# Altium project Linelance.PrjPcb
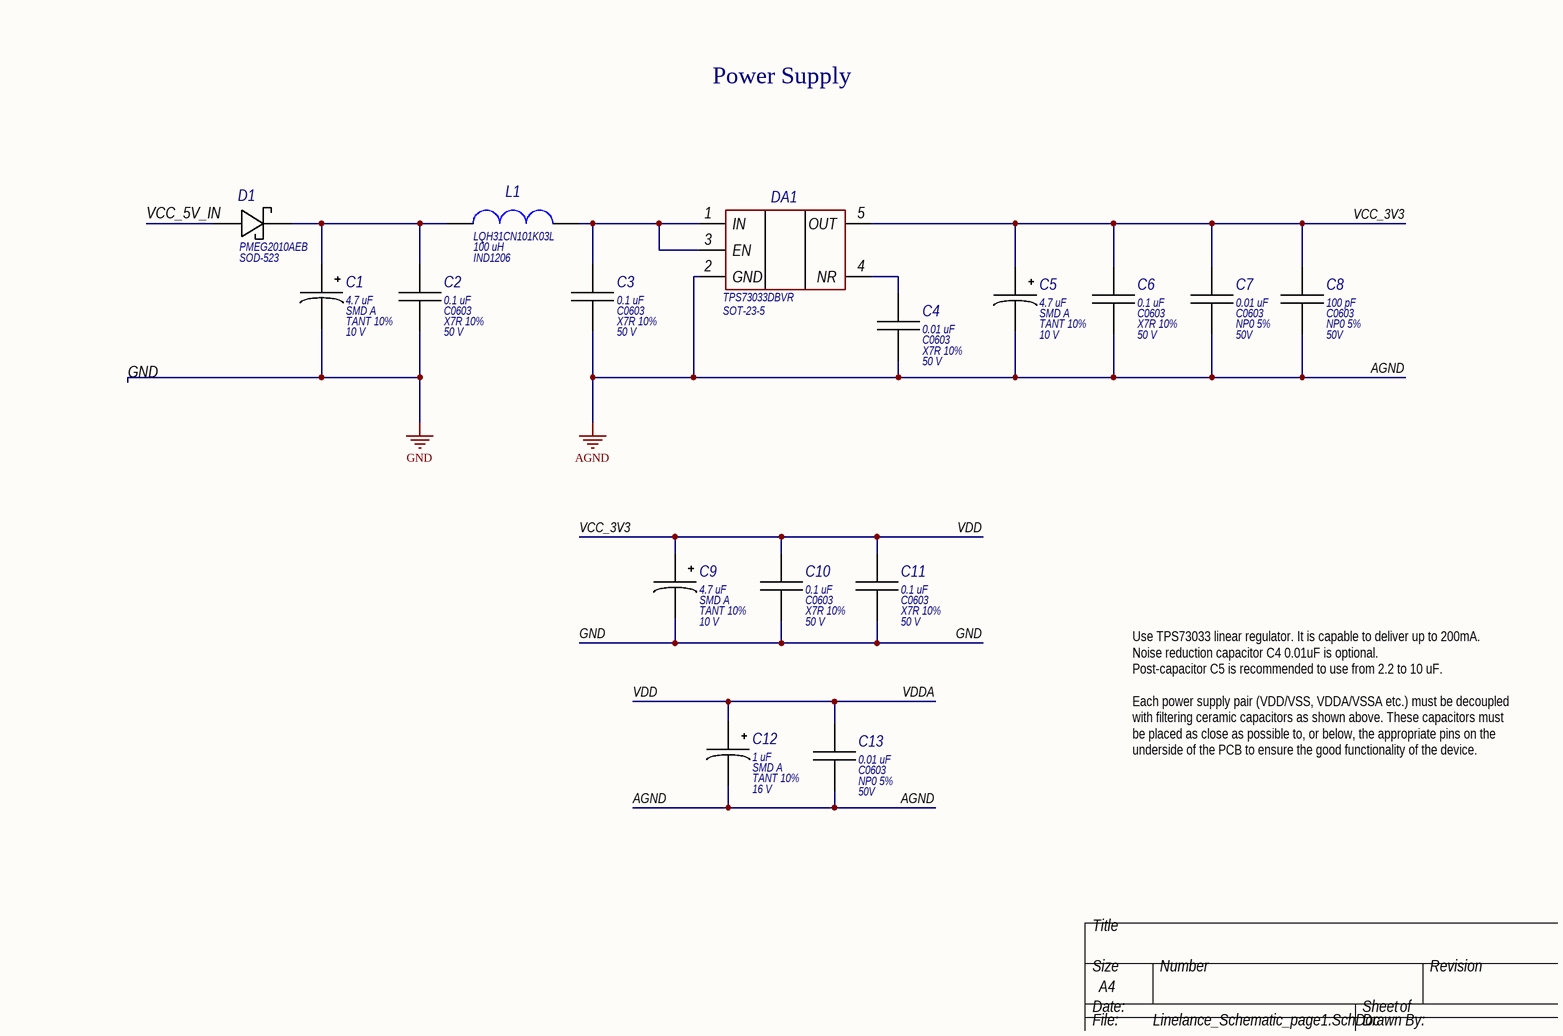
[diagram p0: Linelance_Schematic_page1.SchDoc]
3 sheets, 64 parts. Net scope: global (net labels, ports and power ports of the same name join across sheets).
Board file: Linelance_PCB.PcbDoc
Sheets:
  Linelance_Schematic_page1.SchDoc
  Linelance_Schematic_page2.SchDoc
  Linelance_Schematic_page3.SchDoc

## Sheet Linelance_Schematic_page1.SchDoc
size A4; Author: Dubatouka U.V.; DocumentNumber: 1; SheetNumber: 1; SheetTotal: 3; Scale: 1:1

### Parts
C1  Case: SMD A  Model: TANT 10%  Voltage: 10 V  [TANT-A]  (hidden comment: 4.7 uF)
C2  Model: X7R 10%  Voltage: 50 V  [C0603]  (hidden comment: 0.1 uF)
C3  Model: X7R 10%  Voltage: 50 V  [C0603]  (hidden comment: 0.1 uF)
C4  Model: X7R 10%  Voltage: 50 V  [C0603]  (hidden comment: 0.01 uF)
C5  Case: SMD A  Model: TANT 10%  Voltage: 10 V  [TANT-A]  (hidden comment: 4.7 uF)
C6  Model: X7R 10%  Voltage: 50 V  [C0603]  (hidden comment: 0.1 uF)
C7  Case: С0603  Model: NP0 5%  Voltage: 50V  [C0603]  (hidden comment: 0.01 uF)
C8  Case: С0603  Model: NP0 5%  Voltage: 50V  [C0603]  (hidden comment: 100 pF)
C9  Case: SMD A  Model: TANT 10%  Voltage: 10 V  [TANT-A]  (hidden comment: 4.7 uF)
C10  Model: X7R 10%  Voltage: 50 V  [C0603]  (hidden comment: 0.1 uF)
C11  Model: X7R 10%  Voltage: 50 V  [C0603]  (hidden comment: 0.1 uF)
C12  Case: SMD A  Model: TANT 10%  Voltage: 16 V  [TANT-A]  (hidden comment: 1 uF)
C13  Case: С0603  Model: NP0 5%  Voltage: 50V  [C0603]  (hidden comment: 0.01 uF)
D1  PMEG2010AEB  [SOD-523]
DA1  Model: TPS73033DBVR  [SOT-23-5]
L1  Model: LQH31CN101K03L  [IND1206]  (hidden comment: 100 uH)

### Nets
AGND: C3.2 C4.2 C5.2 C6.2 C7.2 C8.2 C12.2 C13.2 DA1.2(GND)
GND: C1.2 C2.2 C9.2 C10.2 C11.2
VCC_3V3: C5.1 C6.1 C7.1 C8.1 C9.1 C10.1 C11.1 C12.1 C13.1 DA1.5(OUT)  [also labelled VDD, VDDA]
VCC_5V_IN: D1.2
NetC1_1: C1.1 C2.1 D1.1 L1.1
NetC3_1: C3.1 DA1.1(IN) DA1.3(EN) L1.2
NetC4_1: C4.1 DA1.4(NR)

### Notes on the sheet
- Power Supply
- Use TPS73033 linear regulator. It is capable to deliver up to 200mA.
  Noise reduction capacitor C4 0.01uF is optional.
  Post-capacitor C5 is recommended to use from 2.2 to 10 uF.
  Each power supply pair (VDD/VSS, VDDA/VSSA etc.) must be decoupled with filtering ceramic capacitors as shown above. These capacitors must be placed as close as possible to, or below, the appropriate pins on the underside of the PCB to ensure the good functionality of the device.
- Перв. примен.
- Справ. №
- Подп. и дата
- Инв. № дубл.
- Взам. инв. №
- Разраб.
- Изм.
- Лист
- № докум.
- Подп.
- Дата
- Лит.
- Масса
- Масштаб
- Пров.
- Т.контр.
- Листов
- Инв. № подл.
- Утв.
- Н.контр.
- 2.106-A3
- Копировал
- Формат А3

### Library data of the parts
C1 C5 C9 C12 = Capasitor_Tantalum: Manufacturer: China
  C1 C5 C9: Value: 4.7 uF; HelpURL: https://www.chipdip.by/product0/6038
  C12: Value: 1 uF; HelpURL: https://www.chipdip.by/product0/19661
C2-C4 C6-C8 C10 C11 C13 = Capasitor_ceramic: Manufacturer: Murata Manufacturing
  C2 C3 C6 C10 C11: Value: 0.1 uF; Case: C0603; HelpURL: https://www.chipdip.by/product/grm188r71h104k
  C4: Value: 0.01 uF; Case: C0603; HelpURL: https://www.chipdip.by/product/grm188r71h103k
  C7 C13: Value: 0.01 uF; HelpURL: https://www.chipdip.by/product/grm188r71h103k
  C8: Value: 100 pF; HelpURL: https://www.chipdip.by/product/grm1885c1h101j
D1 = Diode Schottky: Manufacturer: Nexperia; Model: PMEG2010AEB; Case: SOD-523; HelpURL: https://www.chipdip.by/product/pmeg2010aeb.115
DA1 = TPS73033DBV: IC REG LINEAR 3.3V 200MA SOT 23-5; Manufacturer: Texas Instruments; Case: SOT-23-5; HelpURL: https://www.chipdip.by/product/tps73033dbvr-2
L1 = Inductivity: Manufacturer: Murata Manufacturing; HelpURL: https://www.chipdip.by/product/lqh31cn101k03l; Case: IND1206; Value: 100 uH

## Sheet Linelance_Schematic_page2.SchDoc
size A4; Author: Dubatouka U.V.; Address1: Address1; Address2: Address2; Address3: Address3; Address4: Address4; DocumentNumber: 2; SheetNumber: 2; SheetTotal: 3; Scale: 1:1; DocumentType: Схема электрическая принципиальная; FirstReferrence: АБВГ.123456.001
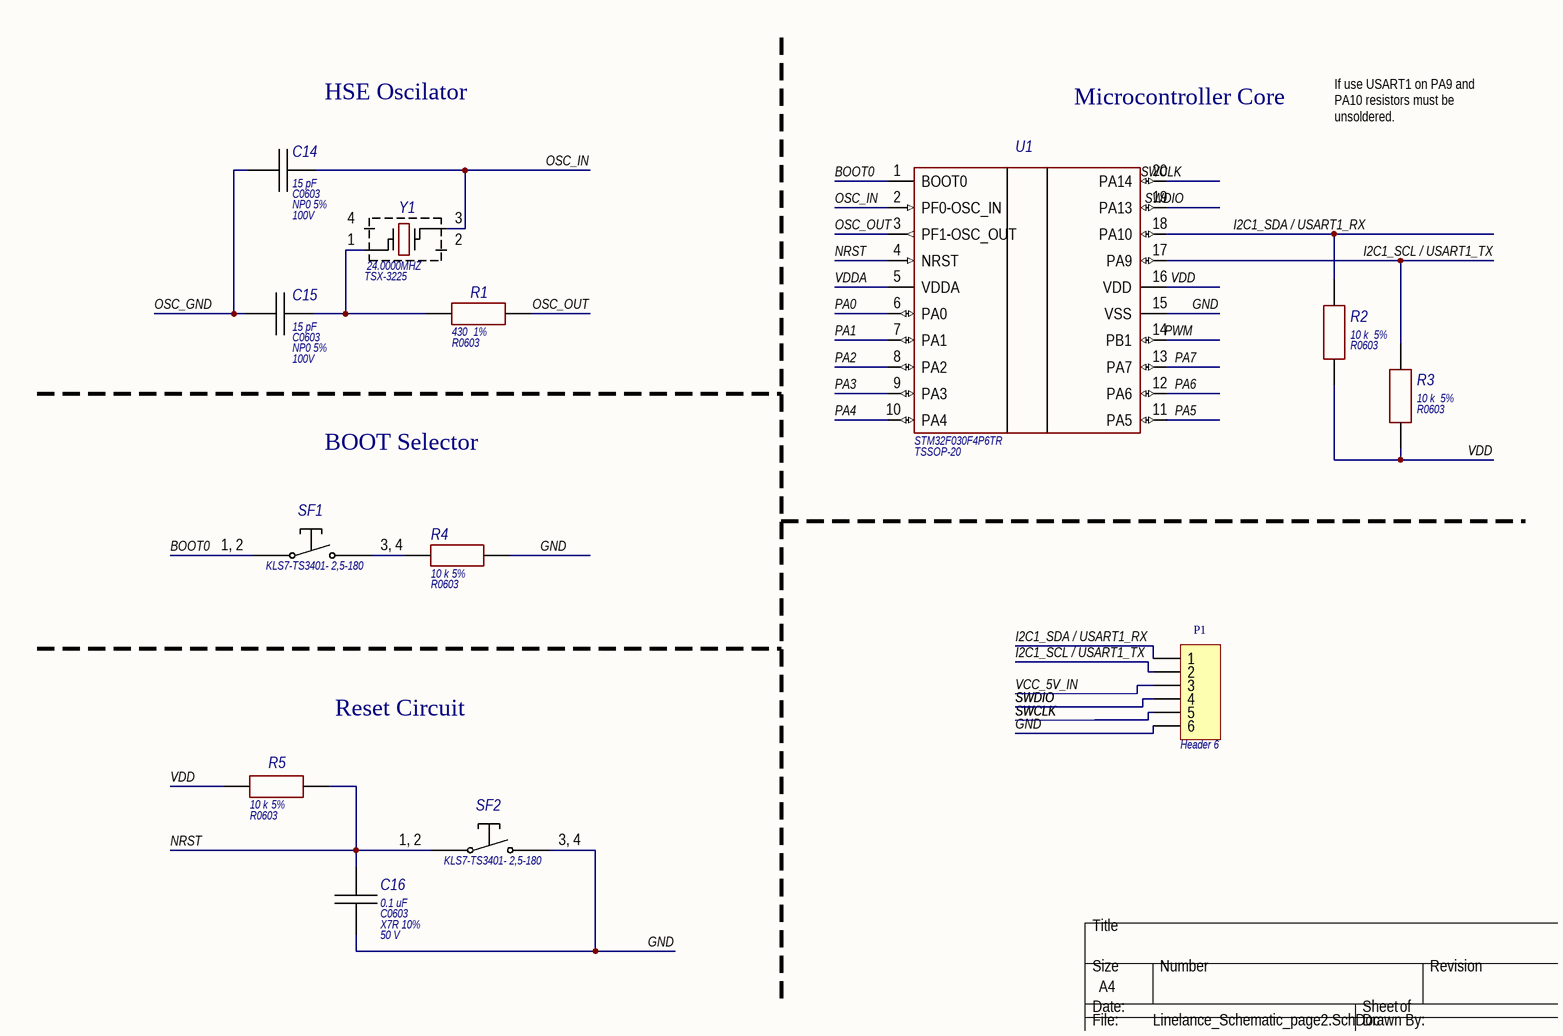
[diagram p1: Linelance_Schematic_page2.SchDoc]

### Parts
C14  Case: С0603  Model: NP0 5%  Voltage: 100V  [C0603]  (hidden comment: 15 pF)
C15  Case: С0603  Model: NP0 5%  Voltage: 100V  [C0603]  (hidden comment: 15 pF)
C16  Model: X7R 10%  Voltage: 50 V  [C0603]  (hidden comment: 0.1 uF)
P1  Header 6  [HDR1X6]
R1  value 430  Model: 1%  [R0603]
R2  value 10 k  Model: 5%  [R0603]
R3  value 10 k  Model: 5%  [R0603]
R4  value 10 k  Model: 5%  [R0603]
R5  value 10 k  Model: 5%  [R0603]
SF1  KLS7-TS3401- 2,5-180  [KMR221GLFS]
SF2  KLS7-TS3401- 2,5-180  [KMR221GLFS]
U1  Model: STM32F030F4P6TR  [TSSOP-20]  (hidden comment: STM32F030F4P6)
Y1  24.0000MHZ  [TSX-3225]

### Nets
GND: C16.2 P1.6 R4.2 SF2.3,_4 U1.15(VSS)
BOOT0: SF1.1,_2 U1.1(BOOT0)
I2C1_SCL / USART1_TX: P1.2 R3.2 U1.17(PA9)
I2C1_SDA / USART1_RX: P1.1 R2.2 U1.18(PA10)
NRST: C16.1 R5.2 SF2.1,_2 U1.4(NRST)
OSC_GND: C14.2 C15.2
OSC_IN: C14.1 U1.2(PF0-OSC_IN) Y1.3
OSC_OUT: R1.2 U1.3(PF1-OSC_OUT)
PA0: U1.6(PA0)
PA1: U1.7(PA1)
PA2: U1.8(PA2)
PA3: U1.9(PA3)
PA4: U1.10(PA4)
PA5: U1.11(PA5)
PA6: U1.12(PA6)
PA7: U1.13(PA7)
PWM: U1.14(PB1)
SWCLK: P1.5 U1.20(PA14)
SWDIO: P1.4 U1.19(PA13)
VCC_5V_IN: P1.3
VDD: R2.1 R3.1 R5.1 U1.5(VDDA) U1.16(VDD)  [also labelled VDDA]  [project net VCC_3V3]
NetC15_1: C15.1 R1.1 Y1.1
NetR4_1: R4.1 SF1.3,_4

Not connected (* = marked no-connect by the designer): Y1 2 4

### Notes on the sheet
- HSE Oscilator
- Microcontroller Core
- If use USART1 on PA9 and PA10 resistors must be unsoldered.
- BOOT Selector
- Reset Circuit
- Перв. примен.
- Справ. №
- Подп. и дата
- Инв. № дубл.
- Взам. инв. №
- Разраб.
- Изм.
- Лист
- № докум.
- Подп.
- Дата
- Лит.
- Масса
- Масштаб
- Пров.
- Т.контр.
- Листов
- Инв. № подл.
- Утв.
- Н.контр.
- 2.106-A3
- Копировал
- Формат А3

### Library data of the parts
C14-C16 = Capasitor_ceramic: Manufacturer: Murata Manufacturing
  C14 C15: Value: 15 pF; HelpURL: https://www.chipdip.by/product/grm1885c2a150j
  C16: Value: 0.1 uF; Case: C0603; HelpURL: https://www.chipdip.by/product/grm188r71h104k
P1 = Header 6: Header, 6-Pin; LatestRevisionDate: 17-Jul-2002; LatestRevisionNote: Re-released for DXP Platform.; Publisher: Altium Limited
R1-R5 = Resistor: Rext.; Case: R0603; Manufacturer: -
  R1: HelpURL: https://www.chipdip.by/product0/9000079667
  R2-R5: HelpURL: https://www.chipdip.by/product0/65097
SF1 SF2 = Button: SWITCH TACTILE SPST-NO 0.05A 32V; Manufacturer: KLS electronic co ltd; HelpURL: https://www.chipdip.by/product/kls7-ts3401-2-5-180-tvaf11; Model: KLS7-TS3401- 2,5-180; Case: KLS7-TS3401
U1 = STM32F030F4P6: IC MCU 32BIT 16KB FLASH 20TSSOP; Manufacturer: STMicroelectronics; Case: TSSOP-20; HelpURL: https://www.chipdip.by/product/stm32f030f4p6
Y1 = Crystal: CRYSTAL 24.0000MHZ 9PF SMD; Manufacturer: EPSON; Model: TSX-3225 24.0000MF20G-AC0; HelpURL: https://www.digikey.com/product-detail/en/epson/TSX-3225-24-0000MF20G-AC0/SER4185TR-ND/2819192; Case: TSX-3225; Value: 24.0000MHZ

## Sheet Linelance_Schematic_page3.SchDoc
size A2; Author: Dubatouka U.V.; Address1: Address1; Address2: Address2; Address3: Address3; Address4: Address4; DocumentNumber: 3; SheetNumber: 3; SheetTotal: 3; Scale: 1:1; DocumentType: Схема электрическая принципиальная; FirstReferrence: АБВГ.123456.001
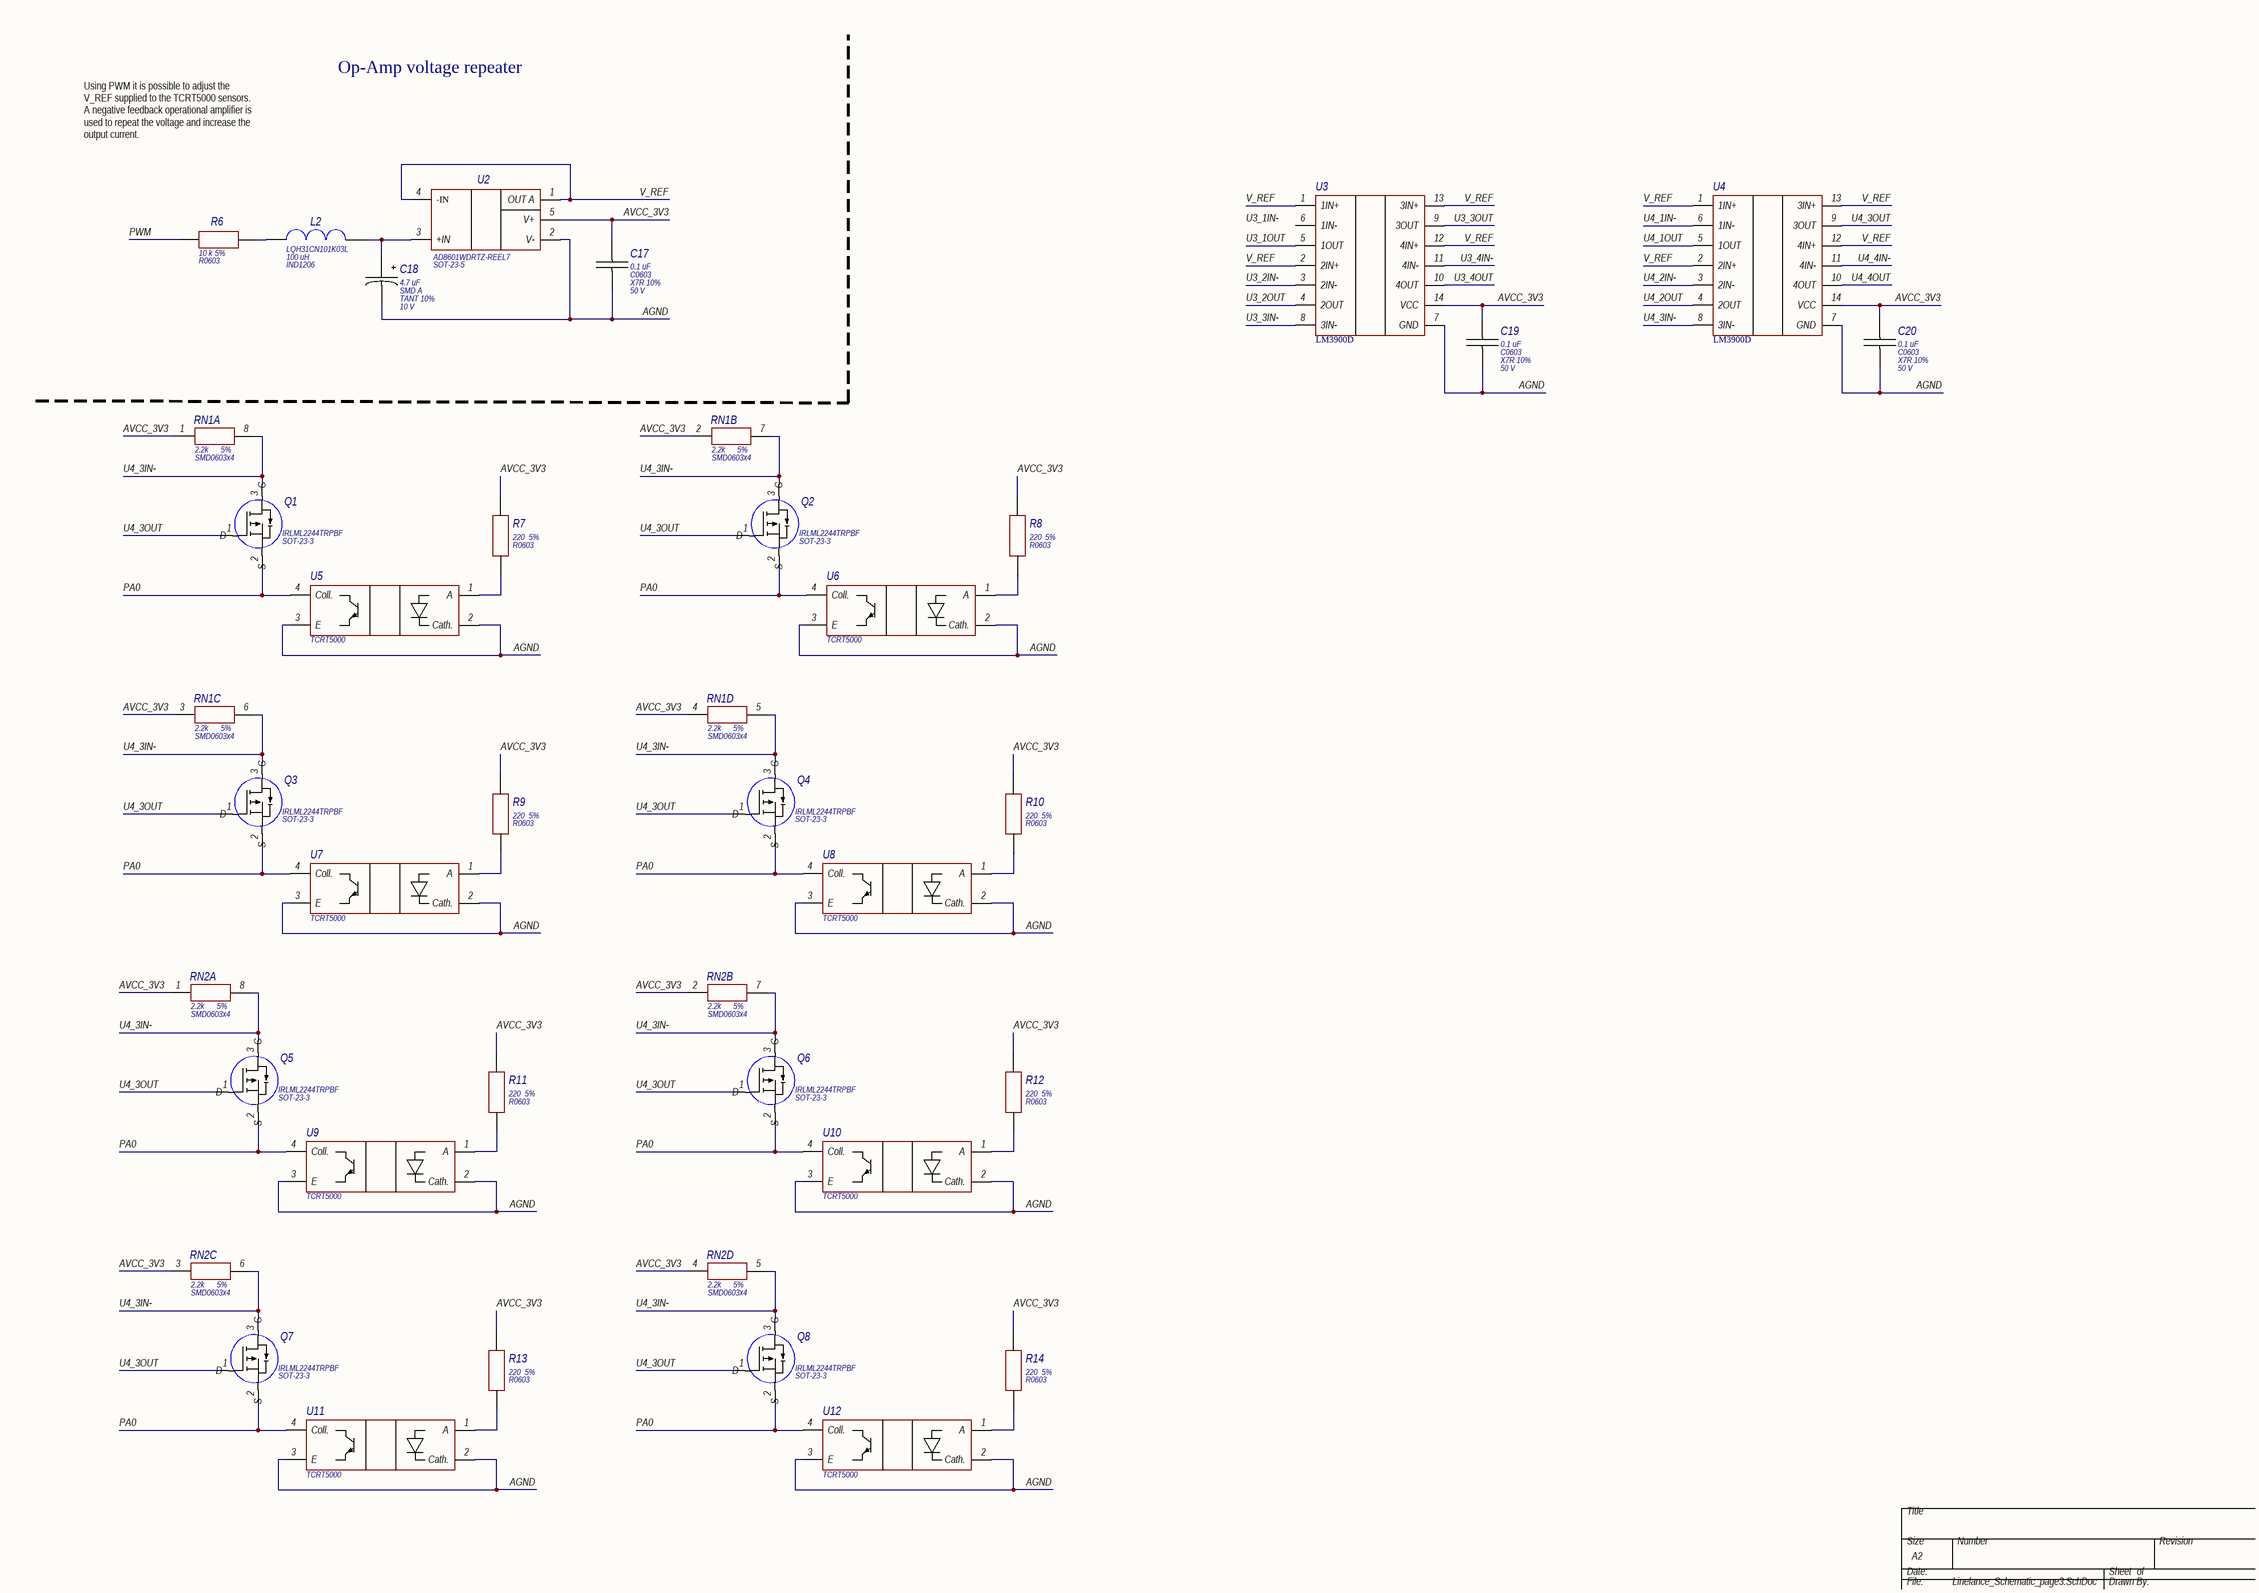
[diagram p2: Linelance_Schematic_page3.SchDoc]

### Parts
C17  Model: X7R 10%  Voltage: 50 V  [C0603]  (hidden comment: 0.1 uF)
C18  Case: SMD A  Model: TANT 10%  Voltage: 10 V  [TANT-A]  (hidden comment: 4.7 uF)
C19  Model: X7R 10%  Voltage: 50 V  [C0603]  (hidden comment: 0.1 uF)
C20  Model: X7R 10%  Voltage: 50 V  [C0603]  (hidden comment: 0.1 uF)
L2  Model: LQH31CN101K03L  [IND1206]  (hidden comment: 100 uH)
Q1  IRLML2244TRPBF  [SOT-23-3]
Q2  IRLML2244TRPBF  [SOT-23-3]
Q3  IRLML2244TRPBF  [SOT-23-3]
Q4  IRLML2244TRPBF  [SOT-23-3]
Q5  IRLML2244TRPBF  [SOT-23-3]
Q6  IRLML2244TRPBF  [SOT-23-3]
Q7  IRLML2244TRPBF  [SOT-23-3]
Q8  IRLML2244TRPBF  [SOT-23-3]
R6  value 10 k  Model: 5%  [R0603]
R7  value 220  Model: 5%  [R0603]
R8  value 220  Model: 5%  [R0603]
R9  value 220  Model: 5%  [R0603]
R10  value 220  Model: 5%  [R0603]
R11  value 220  Model: 5%  [R0603]
R12  value 220  Model: 5%  [R0603]
R13  value 220  Model: 5%  [R0603]
R14  value 220  Model: 5%  [R0603]
RN1  Model: 5%  Case: SMD0603x4  [RN_YC164-JR-072K2L]  (hidden comment: 2.2k)  (parts A,B,C,D of 4)
RN2  Model: 5%  Case: SMD0603x4  [RN_YC164-JR-072K2L]  (hidden comment: 2.2k)  (parts A,B,C,D of 4)
U2  AD8601WDRTZ-REEL7  [SOT-23-5]
U3  LM3900D  [SOIC-14]
U4  LM3900D  [SOIC-14]
U5  TCRT5000  [TCRT5000]
U6  TCRT5000  [TCRT5000]
U7  TCRT5000  [TCRT5000]
U8  TCRT5000  [TCRT5000]
U9  TCRT5000  [TCRT5000]
U10  TCRT5000  [TCRT5000]
U11  TCRT5000  [TCRT5000]
U12  TCRT5000  [TCRT5000]

### Nets
AGND: C17.2 C18.2 C19.2 C20.2 U2.2(V-) U3.7(GND) U4.7(GND) U5.2(Cath.) U5.3(E) U6.2(Cath.) U6.3(E) U7.2(Cath.) U7.3(E) U8.2(Cath.) U8.3(E) U9.2(Cath.) U9.3(E) U10.2(Cath.) U10.3(E) U11.2(Cath.) U11.3(E) U12.2(Cath.) U12.3(E)
AVCC_3V3: C17.1 C19.1 C20.1 R7.2 R8.2 R9.2 R10.2 R11.2 R12.2 R13.2 R14.2 RN1.1 RN1.2 RN1.3 RN1.4 RN2.1 RN2.2 RN2.3 RN2.4 U2.5(V+) U3.14(VCC) U4.14(VCC)
PA0: Q1.2(S) Q2.2(S) Q3.2(S) Q4.2(S) Q5.2(S) Q6.2(S) Q7.2(S) Q8.2(S) U5.4(Coll.) U6.4(Coll.) U7.4(Coll.) U8.4(Coll.) U9.4(Coll.) U10.4(Coll.) U11.4(Coll.) U12.4(Coll.)
PWM: R6.1
U3_1OUT: U3.5(1OUT)
U3_2IN-: U3.3(2IN-)
U3_2OUT: U3.4(2OUT)
U3_3IN-: U3.8(3IN-)
U3_3OUT: U3.9(3OUT)
U3_4IN-: U3.11(4IN-)
U3_4OUT: U3.10(4OUT)
U4_1IN-: U4.6(1IN-)
U4_1OUT: U4.5(1OUT)
U4_2IN-: U4.3(2IN-)
U4_2OUT: U4.4(2OUT)
U4_3IN-: Q1.3(G) Q2.3(G) Q3.3(G) Q4.3(G) Q5.3(G) Q6.3(G) Q7.3(G) Q8.3(G) RN1.5 RN1.6 RN1.7 RN1.8 RN2.5 RN2.6 RN2.7 RN2.8 U4.8(3IN-)
U4_3OUT: Q1.1(D) Q2.1(D) Q3.1(D) Q4.1(D) Q5.1(D) Q6.1(D) Q7.1(D) Q8.1(D) U4.9(3OUT)
U4_4IN-: U4.11(4IN-)
U4_4OUT: U4.10(4OUT)
V_REF: U2.1(OUT_A) U2.4(-IN) U3.1(1IN+) U3.2(2IN+) U3.12(4IN+) U3.13(3IN+) U4.1(1IN+) U4.2(2IN+) U4.12(4IN+) U4.13(3IN+)
NetC18_1: C18.1 L2.2 U2.3(+IN)
NetL2_1: L2.1 R6.2
NetR7_1: R7.1 U5.1(A)
NetR8_1: R8.1 U6.1(A)
NetR9_1: R9.1 U7.1(A)
NetR10_1: R10.1 U8.1(A)
NetR11_1: R11.1 U9.1(A)
NetR12_1: R12.1 U10.1(A)
NetR13_1: R13.1 U11.1(A)
NetR14_1: R14.1 U12.1(A)

Not connected (* = marked no-connect by the designer): U3 6(1IN-)

### Notes on the sheet
- Op-Amp voltage repeater
- Using PWM it is possible to adjust the V_REF supplied to the TCRT5000 sensors.
  A negative feedback operational amplifier is used to repeat the voltage and increase the output current.
- Labels drawn without touching a wire or pin: U3_1IN-
- Перв. примен.
- Справ. №
- Подп. и дата
- Инв. № дубл.
- Взам. инв. №
- Разраб.
- Изм.
- Лист
- № докум.
- Подп.
- Дата
- Лит.
- Масса
- Масштаб
- Пров.
- Т.контр.
- Листов
- Инв. № подл.
- Утв.
- Н.контр.
- 2.106-A3
- Копировал
- Формат А3

### Library data of the parts
C17 C19 C20 = Capasitor_ceramic: Manufacturer: Murata Manufacturing; Value: 0.1 uF; Case: C0603; HelpURL: https://www.chipdip.by/product/grm188r71h104k
C18 = Capasitor_Tantalum: Manufacturer: China; Value: 4.7 uF; HelpURL: https://www.chipdip.by/product0/6038
L2 = Inductivity: Manufacturer: Murata Manufacturing; HelpURL: https://www.chipdip.by/product/lqh31cn101k03l; Case: IND1206; Value: 100 uH
Q1-Q8 = IRLML2244TRPBF: MOSFET P-CH 20V 4.3A SOT23; Manifacturer: Infineon Technologies; Case: SOT-23-3; HelpURL: https://www.chipdip.by/product/irlml2244trpbf; Model: IRLML2244TRPBF
R6-R14 = Resistor: Rext.; Case: R0603; Manufacturer: -
  R6: HelpURL: https://www.chipdip.by/product0/65097
  R7-R14: HelpURL: https://www.chipdip.by/product0/34802
RN1 RN2 = Resistor Network: Manufacturer: Bourns; Value: 2.2k; HelpURL: https://www.chipdip.by/product/cat16-222j4
U2 = AD8601: IC OPAMP GP 1 CIRCUIT SOT23-5; Manufacturer: Analog Devices Inc.; Model: AD8601WDRTZ-REEL7; HelpURL: https://www.digikey.com/product-detail/en/analog-devices-inc/AD8601WDRTZ-REEL7/AD8601WDRTZ-REEL7TR-ND/2237618; Case: SOT-23-5
U3 U4 = LM3900: IC OPAMP GP 4 CIRCUIT 14SOIC; Manufacturer: Texas Instruments; Model: LM3900D; HelpURL: https://www.digikey.com/product-detail/en/texas-instruments/LM3900D/296-9564-5-ND/379857; Case: SOIC-14
U5-U12 = TCRT5000: SENSOR OPTO TRANS 15MM REFL PCB; Manufacturer: Vishay Semiconductor Opto Division; Model: TCRT5000; HelpURL: https://www.digikey.com/product-detail/en/vishay-semiconductor-opto-division/TCRT5000/751-1033-5-ND/1681167; Case: TCRT5000

## Nets that join several sheets
AGND: Linelance_Schematic_page1 (9 pins), Linelance_Schematic_page3 (23 pins)
GND: Linelance_Schematic_page1 (5 pins), Linelance_Schematic_page2 (5 pins)
PA0: Linelance_Schematic_page2 (U1.6), Linelance_Schematic_page3 (16 pins)
PWM: Linelance_Schematic_page2 (U1.14), Linelance_Schematic_page3 (R6.1)
VCC_3V3: Linelance_Schematic_page1 (10 pins), Linelance_Schematic_page2 (5 pins)
VCC_5V_IN: Linelance_Schematic_page1 (D1.2), Linelance_Schematic_page2 (P1.3)